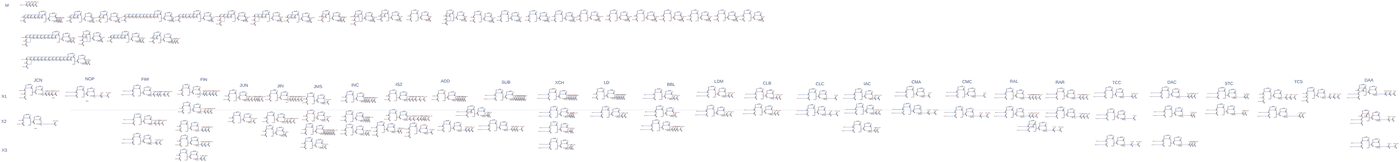
[diagram p0: schematic simple_micro.asc, whole sheet]
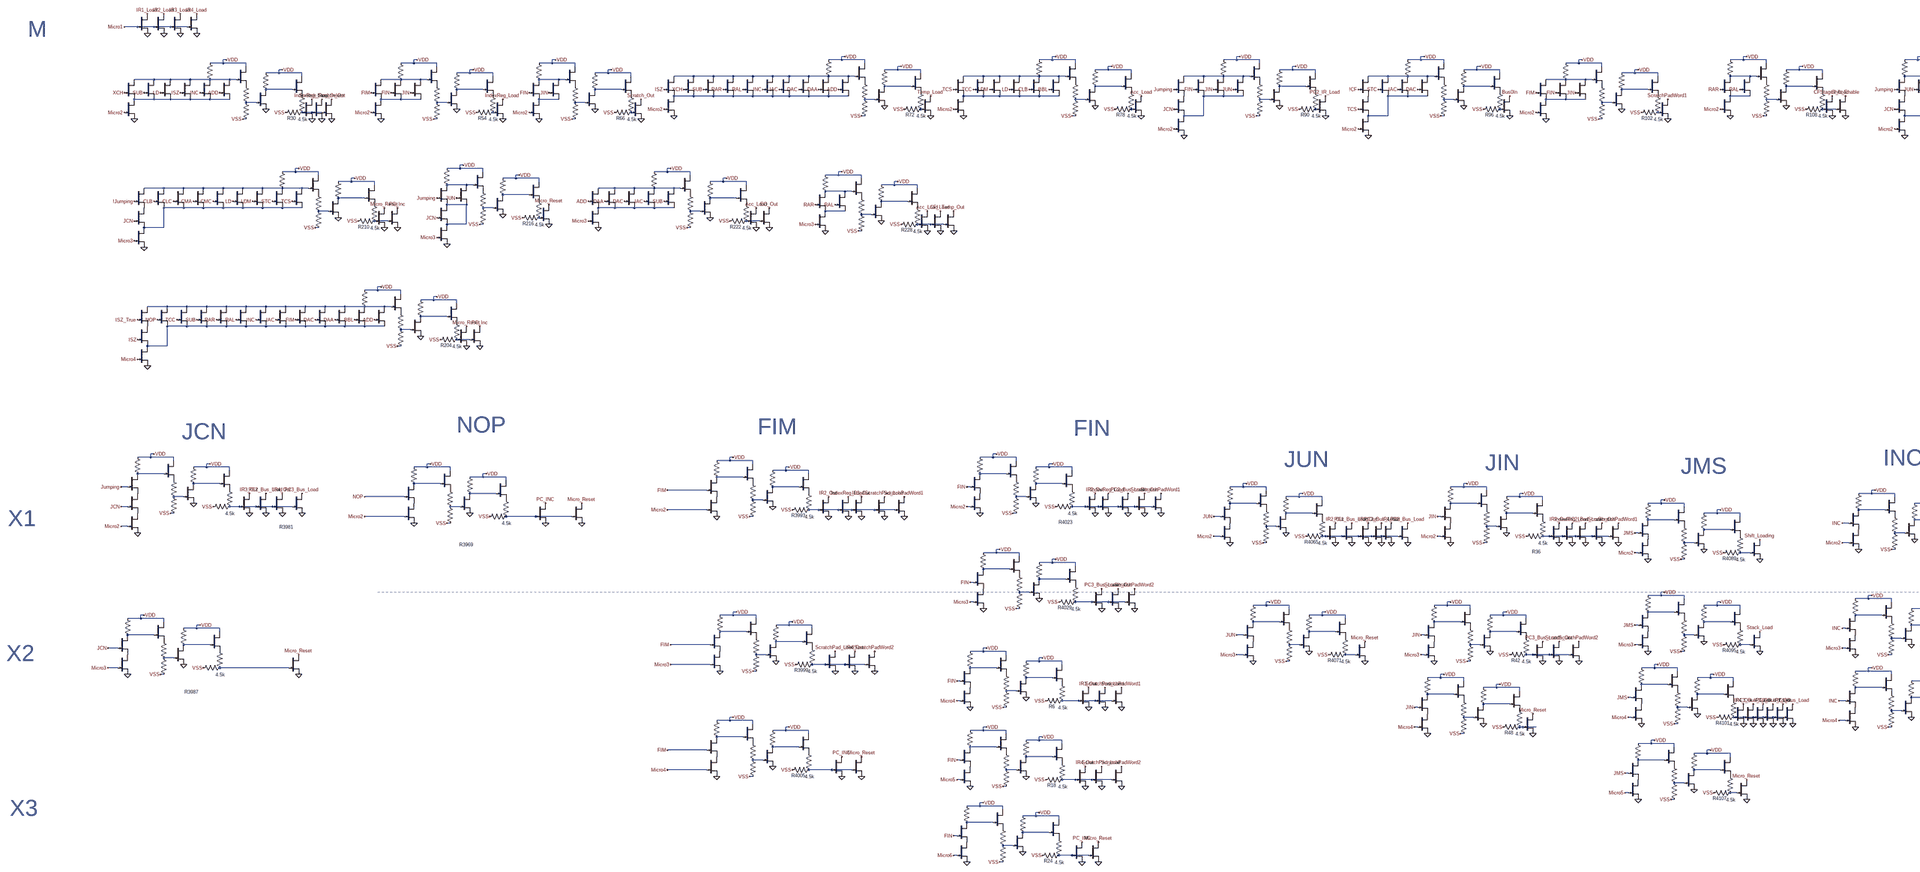
[diagram p1: schematic simple_micro.asc, part, row 1 of 1, column 1 of 4]
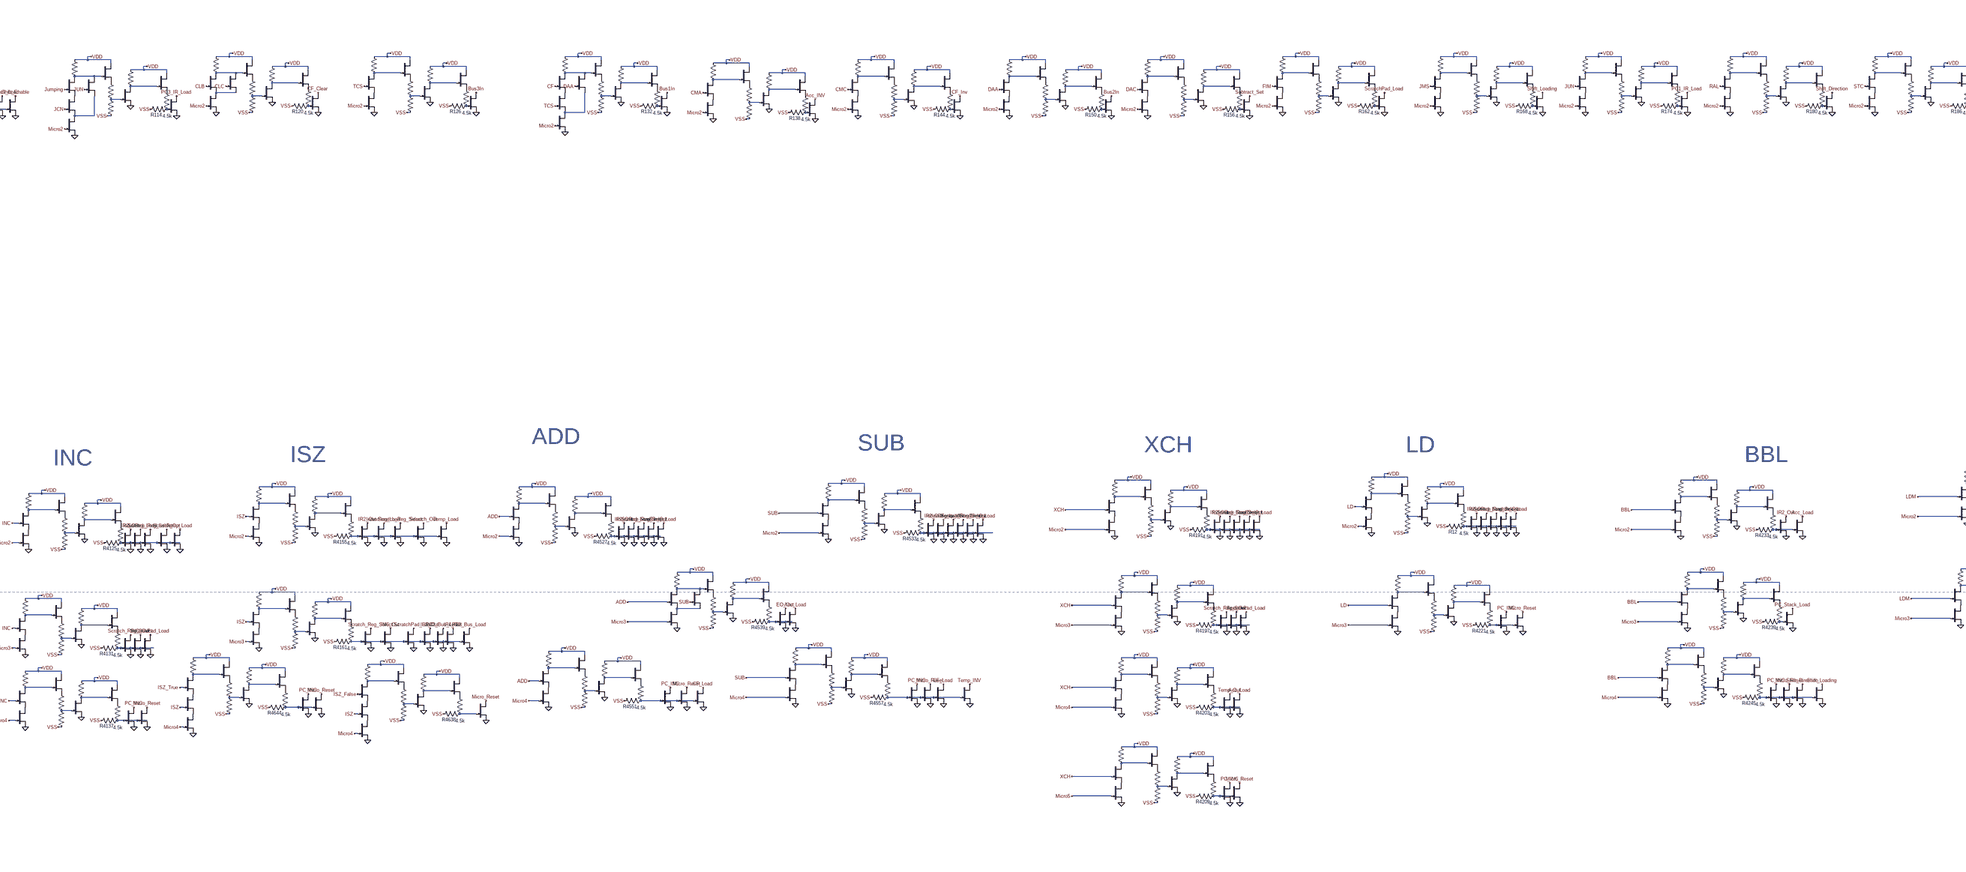
[diagram p2: schematic simple_micro.asc, part, row 1 of 1, column 2 of 4]
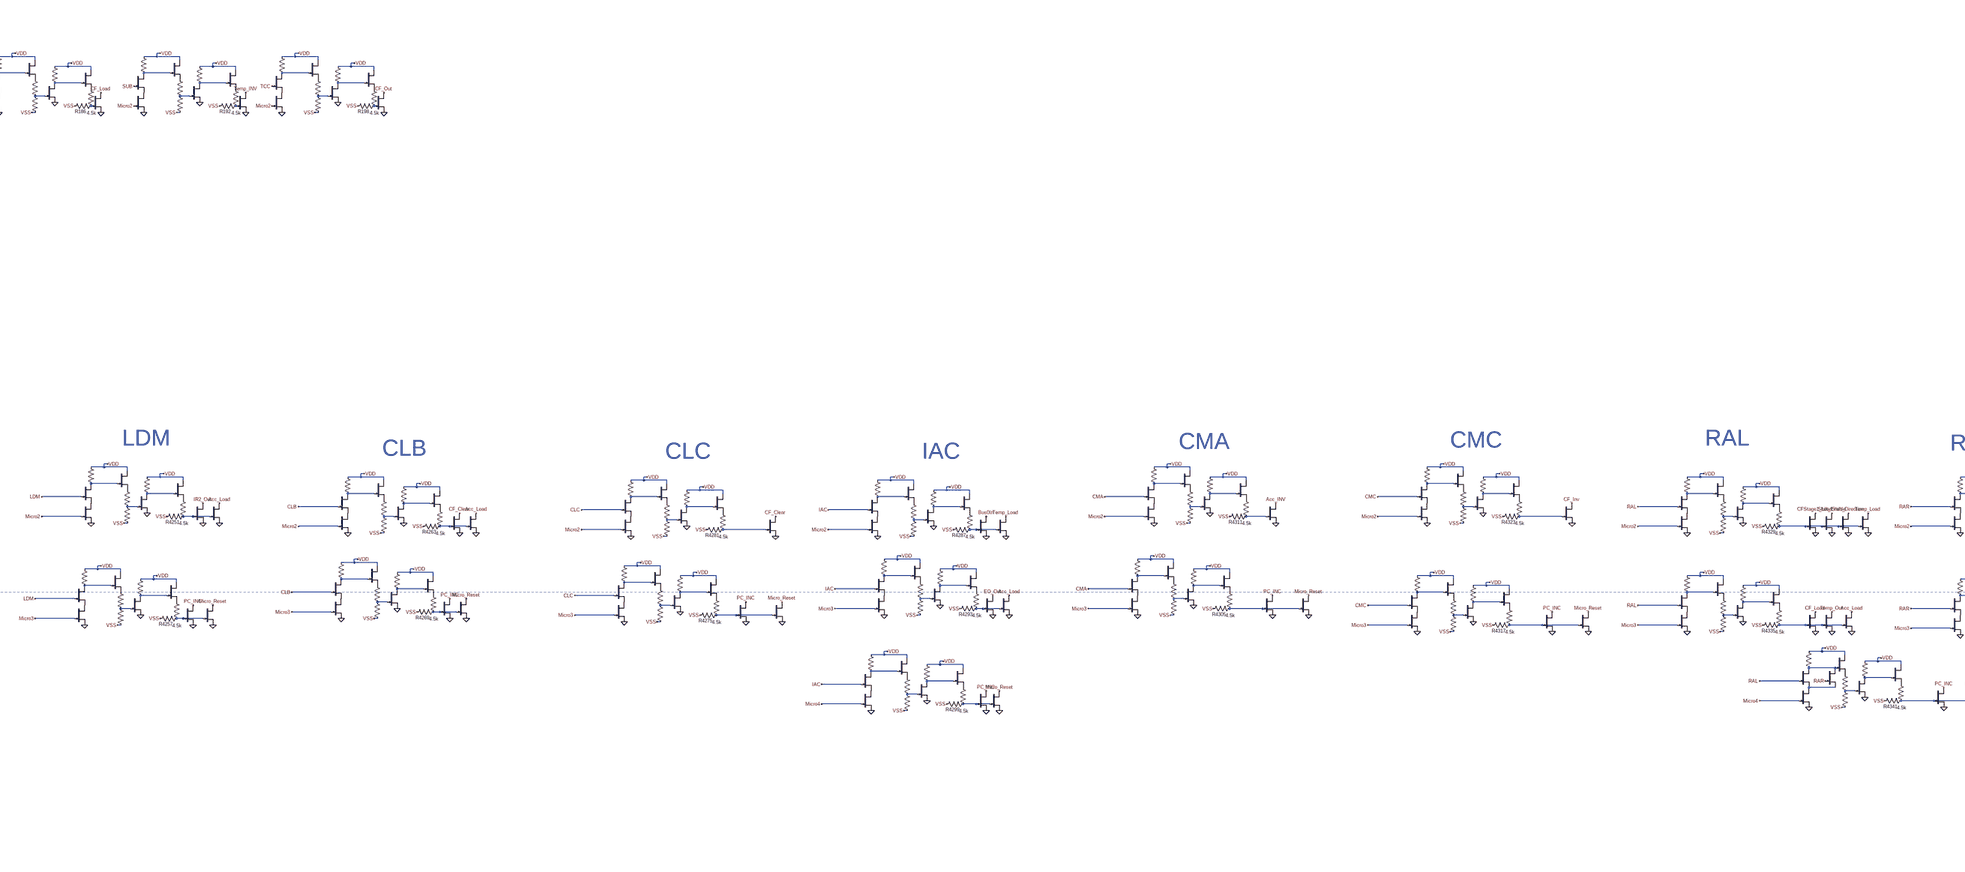
[diagram p3: schematic simple_micro.asc, part, row 1 of 1, column 3 of 4]
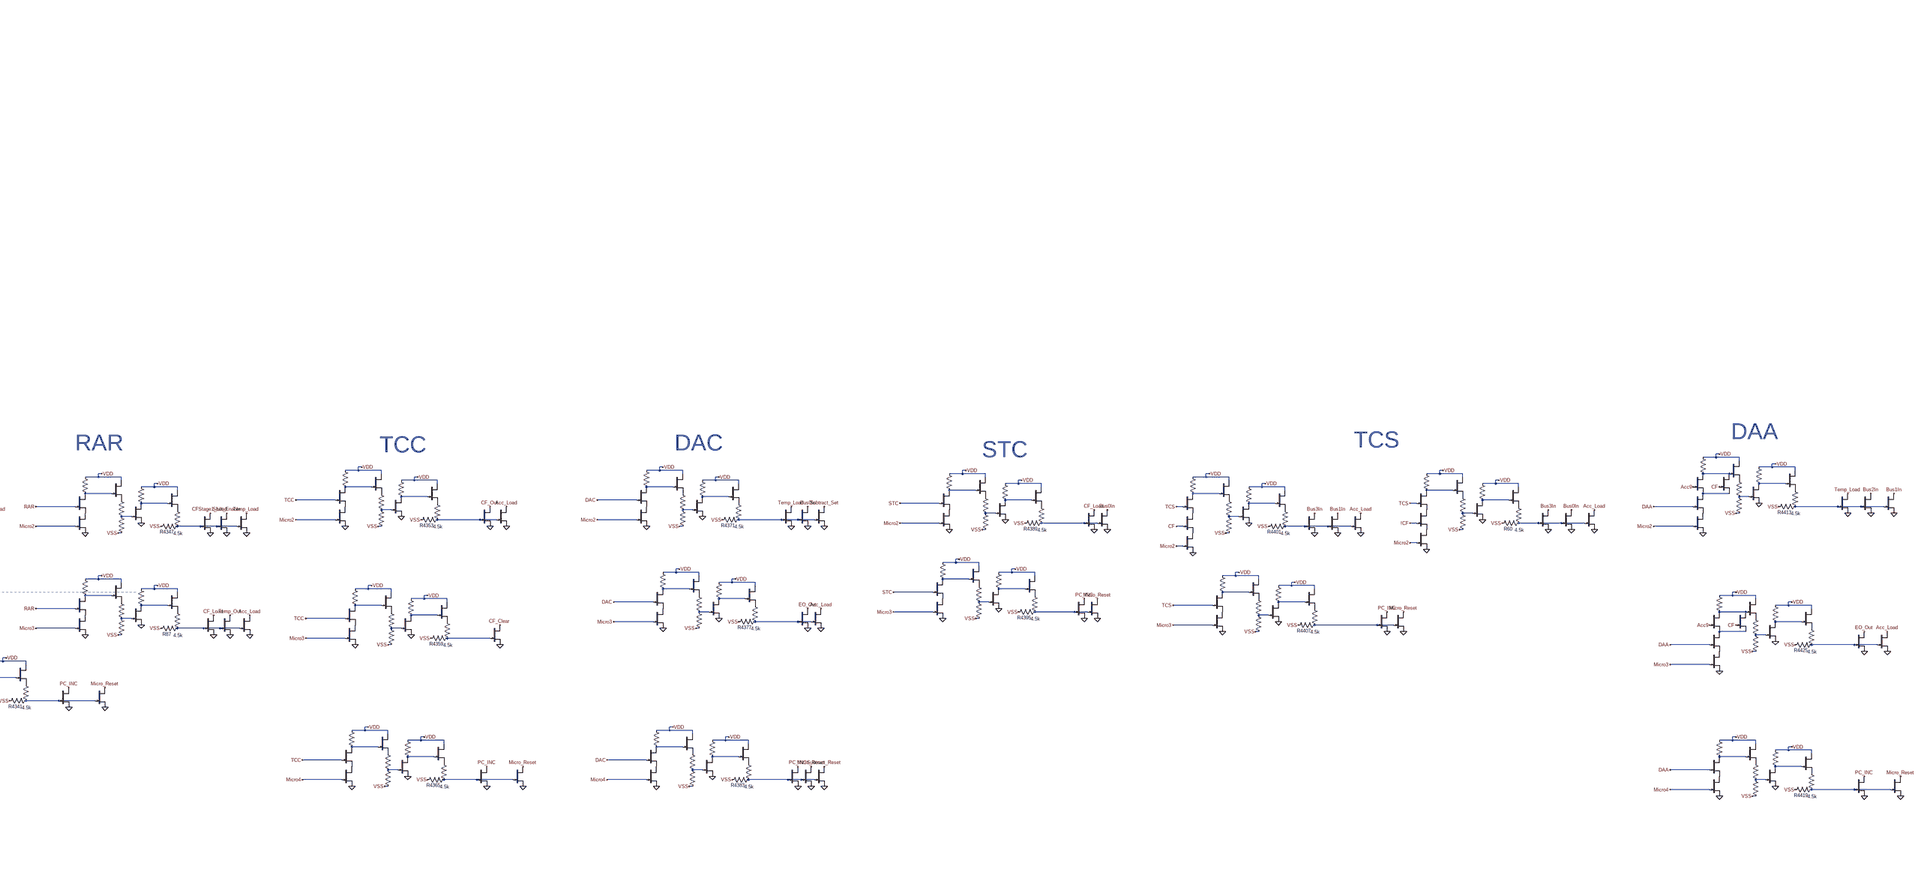
[diagram p4: schematic simple_micro.asc, part, row 1 of 1, column 4 of 4]
* simple_micro.asc
J_A2433 N116 NOP P001 DR
R3964 VDD N116 100k
J_F1003 VDD N116 P002 DR
R3965 P002 N160 1k
R3966 N160 VSS 4.8k
J_B1138 P001 Micro2 0 DR
J_A2434 N127 N160 0 DR
R3967 VDD N127 50k
J_F1004 VDD N127 P003 DR
R3968 P003 N181 1k
R3969 N181 VSS 4.5k
J_Input29 PC_INC N181 0 DR
J_Input30 Micro_Reset N181 0 DR
J_Input31 IR3_Out N159 0 DR
J_Input32 PC2_Bus_Load N159 0 DR
J_A2437 P004 JCN P005 DR
R3976 VDD N111 100k
J_F1007 VDD N111 P006 DR
R3977 P006 N137 1k
R3978 N137 VSS 4.8k
J_B1140 P005 Micro2 0 DR
J_A2438 N115 N137 0 DR
R3979 VDD N115 50k
J_F1008 VDD N115 P007 DR
R3980 P007 N159 1k
R3981 N159 VSS 4.5k
J_Input33 IR4_Out N159 0 DR
J_Input34 PC3_Bus_Load N159 0 DR
J_A2439 N307 JCN P008 DR
R3982 VDD N307 100k
J_F1009 VDD N307 P009 DR
R3983 P009 N323 1k
R3984 N323 VSS 4.8k
J_B1141 P008 Micro3 0 DR
J_A2440 N314 N323 0 DR
R3985 VDD N314 50k
J_F1010 VDD N314 P010 DR
R3986 P010 N327 1k
R3987 N327 VSS 4.5k
J_Input35 Micro_Reset N327 0 DR
J_A2441 N111 Jumping P004 DR
J_A2443 N114 FIM P011 DR
R3988 VDD N114 100k
J_F1011 VDD N114 P012 DR
R3989 P012 N146 1k
R3990 N146 VSS 4.8k
J_B1142 P011 Micro2 0 DR
J_A2444 N122 N146 0 DR
R3991 VDD N122 50k
J_F1012 VDD N122 P013 DR
R3992 P013 N170 1k
R3993 N170 VSS 4.5k
J_Input36 IR2_Out N170 0 DR
J_Input38 IndexReg_Load N170 0 DR
J_A2445 N302 FIM P014 DR
R3994 VDD N302 100k
J_F1013 VDD N302 P015 DR
R3995 P015 N320 1k
R3996 N320 VSS 4.8k
J_B1143 P014 Micro3 0 DR
J_A2446 N312 N320 0 DR
R3997 VDD N312 50k
J_F1014 VDD N312 P016 DR
R3998 P016 N324 1k
R3999 N324 VSS 4.5k
J_Input39 IR3_Out N170 0 DR
J_Input40 ScratchPad_Load N170 0 DR
J_A2447 N375 FIM P017 DR
R4000 VDD N375 100k
J_F1015 VDD N375 P018 DR
R4001 P018 N384 1k
R4002 N384 VSS 4.8k
J_B1144 P017 Micro4 0 DR
J_A2448 N376 N384 0 DR
R4003 VDD N376 50k
J_F1016 VDD N376 P019 DR
R4004 P019 N388 1k
R4005 N388 VSS 4.5k
J_Input41 IR4_Out N324 0 DR
J_Input43 ScratchPad_Load N324 0 DR
J_Input46 PC_INC N388 0 DR
J_Input47 Micro_Reset N388 0 DR
J_Input49 IndexReg_Load N161 0 DR
J_A2453 N112 FIN P020 DR
R4018 VDD N112 100k
J_F1021 VDD N112 P021 DR
R4019 P021 N138 1k
R4020 N138 VSS 4.8k
J_B1147 P020 Micro2 0 DR
J_A2454 N117 N138 0 DR
R4021 VDD N117 50k
J_F1022 VDD N117 P022 DR
R4022 P022 N161 1k
R4023 N161 VSS 4.5k
J_Input50 IR2_Out N161 0 DR
J_A2455 N224 FIN P023 DR
R4024 VDD N224 100k
J_F1023 VDD N224 P024 DR
R4025 P024 N239 1k
R4026 N239 VSS 4.8k
J_B1148 P023 Micro3 0 DR
J_A2456 N227 N239 0 DR
R4027 VDD N227 50k
J_F1024 VDD N227 P025 DR
R4028 P025 N253 1k
R4029 N253 VSS 4.5k
J_Input51 PC2_Bus_Load N161 0 DR
J_Input53 Scratch_Out N161 0 DR
J_Input59 PC_INC N406 0 DR
J_Input60 Micro_Reset N406 0 DR
J_A2467 N150 JUN P026 DR
R4060 VDD N150 100k
J_F1035 VDD N150 P027 DR
R4061 P027 N201 1k
R4062 N201 VSS 4.8k
J_B1154 P026 Micro2 0 DR
J_A2468 N175 N201 0 DR
R4063 VDD N175 50k
J_F1036 VDD N175 P028 DR
R4064 P028 N217 1k
R4065 N217 VSS 4.5k
J_Input71 IR2_Out N217 0 DR
J_Input72 PC1_Bus_Load N217 0 DR
J_A2469 N287 JUN P029 DR
R4066 VDD N287 100k
J_F1037 VDD N287 P030 DR
R4067 P030 N315 1k
R4068 N315 VSS 4.8k
J_B1155 P029 Micro3 0 DR
J_A2470 N303 N315 0 DR
R4069 VDD N303 50k
J_F1038 VDD N303 P031 DR
R4070 P031 N321 1k
R4071 N321 VSS 4.5k
J_Input73 IR3_Out N217 0 DR
J_Input74 PC2_Bus_Load N217 0 DR
J_Input75 IR4_Out N217 0 DR
J_Input76 PC3_Bus_Load N217 0 DR
J_Input78 Micro_Reset N321 0 DR
J_A2475 N190 JMS P032 DR
R4084 VDD N190 100k
J_F1043 VDD N190 P033 DR
R4085 P033 N221 1k
R4086 N221 VSS 4.8k
J_B1158 P032 Micro2 0 DR
J_A2476 N210 N221 0 DR
R4087 VDD N210 50k
J_F1044 VDD N210 P034 DR
R4088 P034 N223 1k
R4089 N223 VSS 4.5k
J_Input94 Shift_Loading N223 0 DR
J_A2477 N269 JMS P035 DR
R4090 VDD N269 100k
J_F1045 VDD N269 P036 DR
R4091 P036 N308 1k
R4092 N308 VSS 4.8k
J_B1159 P035 Micro3 0 DR
J_A2478 N289 N308 0 DR
R4093 VDD N289 50k
J_F1046 VDD N289 P037 DR
R4094 P037 N317 1k
R4095 N317 VSS 4.5k
J_Input95 Stack_Load N317 0 DR
J_A2479 N341 JMS P038 DR
R4096 VDD N341 100k
J_F1047 VDD N341 P039 DR
R4097 P039 N366 1k
R4098 N366 VSS 4.8k
J_B1160 P038 Micro4 0 DR
J_A2480 N353 N366 0 DR
R4099 VDD N353 50k
J_F1048 VDD N353 P040 DR
R4100 P040 N372 1k
R4101 N372 VSS 4.5k
J_Input96 IR2_Out N372 0 DR
J_Input97 PC1_Bus_Load N372 0 DR
J_A2481 N385 JMS P041 DR
R4102 VDD N385 100k
J_F1049 VDD N385 P042 DR
R4103 P042 N398 1k
R4104 N398 VSS 4.8k
J_B1161 P041 Micro5 0 DR
J_A2482 N390 N398 0 DR
R4105 VDD N390 50k
J_F1050 VDD N390 P043 DR
R4106 P043 N401 1k
R4107 N401 VSS 4.5k
J_Input98 IR3_Out N372 0 DR
J_Input99 PC2_Bus_Load N372 0 DR
J_Input100 IR4_Out N372 0 DR
J_Input101 PC3_Bus_Load N372 0 DR
J_Input103 Micro_Reset N401 0 DR
J_A2487 N171 INC P044 DR
R4120 VDD N171 100k
J_F1055 VDD N171 P045 DR
R4121 P045 N215 1k
R4122 N215 VSS 4.8k
J_B1164 P044 Micro2 0 DR
J_A2488 N191 N215 0 DR
R4123 VDD N191 50k
J_F1056 VDD N191 P046 DR
R4124 P046 N222 1k
R4125 N222 VSS 4.5k
J_Input104 IR2_Out N222 0 DR
J_Input105 IndexReg_Load N222 0 DR
J_A2489 N276 INC P047 DR
R4126 VDD N276 100k
J_F1057 VDD N276 P048 DR
R4127 P048 N310 1k
R4128 N310 VSS 4.8k
J_B1165 P047 Micro3 0 DR
J_A2490 N294 N310 0 DR
R4129 VDD N294 50k
J_F1058 VDD N294 P049 DR
R4130 P049 N319 1k
R4131 N319 VSS 4.5k
J_Input106 Scratch_Out N222 0 DR
J_Input107 ScratchPad_Load N319 0 DR
J_A2491 N344 INC P050 DR
R4132 VDD N344 100k
J_F1059 VDD N344 P051 DR
R4133 P051 N369 1k
R4134 N369 VSS 4.8k
J_B1166 P050 Micro4 0 DR
J_A2492 N355 N369 0 DR
R4135 VDD N355 50k
J_F1060 VDD N355 P052 DR
R4136 P052 N373 1k
R4137 N373 VSS 4.5k
J_Input108 INC_Out N319 0 DR
J_Input109 Temp_Load N222 0 DR
J_Input112 PC_INC N373 0 DR
J_Input113 Micro_Reset N373 0 DR
J_A2497 N152 ISZ P053 DR
R4150 VDD N152 100k
J_F1065 VDD N152 P054 DR
R4151 P054 N203 1k
R4152 N203 VSS 4.8k
J_B1169 P053 Micro2 0 DR
J_A2498 N177 N203 0 DR
R4153 VDD N177 50k
J_F1066 VDD N177 P055 DR
R4154 P055 N219 1k
R4155 N219 VSS 4.5k
J_Input114 IR2_Out N219 0 DR
J_Input115 IndexReg_Load N219 0 DR
J_A2499 N264 ISZ P056 DR
R4156 VDD N264 100k
J_F1067 VDD N264 P057 DR
R4157 P057 N305 1k
R4158 N305 VSS 4.8k
J_B1170 P056 Micro3 0 DR
J_A2500 N284 N305 0 DR
R4159 VDD N284 50k
J_F1068 VDD N284 P058 DR
R4160 P058 N313 1k
R4161 N313 VSS 4.5k
J_Input116 Scratch_Out N219 0 DR
J_Input119 Temp_Load N219 0 DR
J_Input122 PC_INC N367 0 DR
J_Input123 Micro_Reset N367 0 DR
J_Input124 PC2_Bus_Load N313 0 DR
J_Input125 IR3_Out N313 0 DR
J_Input126 IR4_Out N313 0 DR
J_Input127 PC3_Bus_Load N313 0 DR
J_A2511 N139 XCH P059 DR
R4186 VDD N139 100k
J_F1077 VDD N139 P060 DR
R4187 P060 N192 1k
R4188 N192 VSS 4.8k
J_B1175 P059 Micro2 0 DR
J_A2512 N162 N192 0 DR
R4189 VDD N162 50k
J_F1078 VDD N162 P061 DR
R4190 P061 N211 1k
R4191 N211 VSS 4.5k
J_Input128 IR2_Out N211 0 DR
J_Input129 IndexReg_Load N211 0 DR
J_A2513 N240 XCH P062 DR
R4192 VDD N240 100k
J_F1079 VDD N240 P063 DR
R4193 P063 N277 1k
R4194 N277 VSS 4.8k
J_B1176 P062 Micro3 0 DR
J_A2514 N254 N277 0 DR
R4195 VDD N254 50k
J_F1080 VDD N254 P064 DR
R4196 P064 N295 1k
R4197 N295 VSS 4.5k
J_Input130 Scratch_Out N211 0 DR
J_Input131 Temp_Load N211 0 DR
J_A2515 N334 XCH P065 DR
R4198 VDD N334 100k
J_F1081 VDD N334 P066 DR
R4199 P066 N358 1k
R4200 N358 VSS 4.8k
J_B1177 P065 Micro4 0 DR
J_A2516 N343 N358 0 DR
R4201 VDD N343 50k
J_F1082 VDD N343 P067 DR
R4202 P067 N368 1k
R4203 N368 VSS 4.5k
J_Input132 Acc_Out N295 0 DR
J_Input133 ScratchPad_Load N295 0 DR
J_A2517 N386 XCH P068 DR
R4204 VDD N386 100k
J_F1083 VDD N386 P069 DR
R4205 P069 N399 1k
R4206 N399 VSS 4.8k
J_B1178 P068 Micro5 0 DR
J_A2518 N393 N399 0 DR
R4207 VDD N393 50k
J_F1084 VDD N393 P070 DR
R4208 P070 N402 1k
R4209 N402 VSS 4.5k
J_Input134 Temp_Out N368 0 DR
J_Input135 Acc_Load N368 0 DR
J_Input136 PC_INC N402 0 DR
J_Input137 Micro_Reset N402 0 DR
J_A2521 N241 LD P071 DR
R4216 VDD N241 100k
J_F1087 VDD N241 P072 DR
R4217 P072 N278 1k
R4218 N278 VSS 4.8k
J_B1180 P071 Micro3 0 DR
J_A2522 N255 N278 0 DR
R4219 VDD N255 50k
J_F1088 VDD N255 P073 DR
R4220 P073 N296 1k
R4221 N296 VSS 4.5k
J_Input138 Scratch_Out N205 0 DR
J_Input139 Acc_Load N205 0 DR
J_Input140 PC_INC N296 0 DR
J_Input141 Micro_Reset N296 0 DR
J_A2526 N140 BBL P074 DR
R4228 VDD N140 100k
J_F1091 VDD N140 P075 DR
R4229 P075 N193 1k
R4230 N193 VSS 4.8k
J_B1182 P074 Micro2 0 DR
J_A2527 N163 N193 0 DR
R4231 VDD N163 50k
J_F1092 VDD N163 P076 DR
R4232 P076 N212 1k
R4233 N212 VSS 4.5k
J_Input142 IR2_Out N212 0 DR
J_Input143 Acc_Load N212 0 DR
J_Input144 Shift_Direction N359 0 DR
J_Input145 Shift_Loading N359 0 DR
J_A2528 N235 BBL P077 DR
R4234 VDD N235 100k
J_F1093 VDD N235 P078 DR
R4235 P078 N271 1k
R4236 N271 VSS 4.8k
J_B1183 P077 Micro3 0 DR
J_A2529 N249 N271 0 DR
R4237 VDD N249 50k
J_F1094 VDD N249 P079 DR
R4238 P079 N291 1k
R4239 N291 VSS 4.5k
J_Input146 PC_Stack_Load N291 0 DR
J_A2530 N326 BBL P080 DR
R4240 VDD N326 100k
J_F1095 VDD N326 P081 DR
R4241 P081 N346 1k
R4242 N346 VSS 4.8k
J_B1184 P080 Micro4 0 DR
J_A2531 N335 N346 0 DR
R4243 VDD N335 50k
J_F1096 VDD N335 P082 DR
R4244 P082 N359 1k
R4245 N359 VSS 4.5k
J_Input147 PC_INC N359 0 DR
J_Input148 Micro_Reset N359 0 DR
J_A2532 N118 LDM P083 DR
R4246 VDD N118 100k
J_F1097 VDD N118 P084 DR
R4247 P084 N164 1k
R4248 N164 VSS 4.8k
J_B1185 P083 Micro2 0 DR
J_A2533 N129 N164 0 DR
R4249 VDD N129 50k
J_F1098 VDD N129 P085 DR
R4250 P085 N183 1k
R4251 N183 VSS 4.5k
J_Input149 IR2_Out N183 0 DR
J_Input150 Acc_Load N183 0 DR
J_A2534 N231 LDM P086 DR
R4252 VDD N231 100k
J_F1099 VDD N231 P087 DR
R4253 P087 N266 1k
R4254 N266 VSS 4.8k
J_B1186 P086 Micro3 0 DR
J_A2535 N246 N266 0 DR
R4255 VDD N246 50k
J_F1100 VDD N246 P088 DR
R4256 P088 N285 1k
R4257 N285 VSS 4.5k
J_Input151 PC_INC N285 0 DR
J_Input152 Micro_Reset N285 0 DR
J_Input153 Acc_Load N206 0 DR
J_A2536 N130 CLB P089 DR
R4258 VDD N130 100k
J_F1101 VDD N130 P090 DR
R4259 P090 N184 1k
R4260 N184 VSS 4.8k
J_B1187 P089 Micro2 0 DR
J_A2537 N155 N184 0 DR
R4261 VDD N155 50k
J_F1102 VDD N155 P091 DR
R4262 P091 N206 1k
R4263 N206 VSS 4.5k
J_Input154 CF_Clear N206 0 DR
J_A2538 N228 CLB P092 DR
R4264 VDD N228 100k
J_F1103 VDD N228 P093 DR
R4265 P093 N256 1k
R4266 N256 VSS 4.8k
J_B1188 P092 Micro3 0 DR
J_A2539 N236 N256 0 DR
R4267 VDD N236 50k
J_F1104 VDD N236 P094 DR
R4268 P094 N272 1k
R4269 N272 VSS 4.5k
J_Input155 PC_INC N272 0 DR
J_Input156 Micro_Reset N272 0 DR
J_A2540 N230 CLC P095 DR
R4270 VDD N230 100k
J_F1105 VDD N230 P096 DR
R4271 P096 N261 1k
R4272 N261 VSS 4.8k
J_B1189 P095 Micro3 0 DR
J_A2541 N242 N261 0 DR
R4273 VDD N242 50k
J_F1106 VDD N242 P097 DR
R4274 P097 N279 1k
R4275 N279 VSS 4.5k
J_Input157 PC_INC N279 0 DR
J_Input158 Micro_Reset N279 0 DR
J_A2542 N141 CLC P098 DR
R4276 VDD N141 100k
J_F1107 VDD N141 P099 DR
R4277 P099 N194 1k
R4278 N194 VSS 4.8k
J_B1190 P098 Micro2 0 DR
J_A2543 N165 N194 0 DR
R4279 VDD N165 50k
J_F1108 VDD N165 P100 DR
R4280 P100 N213 1k
R4281 N213 VSS 4.5k
J_Input159 CF_Clear N213 0 DR
J_Input160 Temp_Load N214 0 DR
J_A2544 N142 IAC P101 DR
R4282 VDD N142 100k
J_F1109 VDD N142 P102 DR
R4283 P102 N195 1k
R4284 N195 VSS 4.8k
J_B1191 P101 Micro2 0 DR
J_A2545 N166 N195 0 DR
R4285 VDD N166 50k
J_F1110 VDD N166 P103 DR
R4286 P103 N214 1k
R4287 N214 VSS 4.5k
J_Input161 Bus0In N214 0 DR
J_A2546 N225 IAC P104 DR
R4288 VDD N225 100k
J_F1111 VDD N225 P105 DR
R4289 P105 N250 1k
R4290 N250 VSS 4.8k
J_B1192 P104 Micro3 0 DR
J_A2547 N232 N250 0 DR
R4291 VDD N232 50k
J_F1112 VDD N232 P106 DR
R4292 P106 N267 1k
R4293 N267 VSS 4.5k
J_Input162 EO_Out N267 0 DR
J_Input163 Acc_Load N267 0 DR
J_A2548 N331 IAC P107 DR
R4294 VDD N331 100k
J_F1113 VDD N331 P108 DR
R4295 P108 N354 1k
R4296 N354 VSS 4.8k
J_B1193 P107 Micro4 0 DR
J_A2549 N340 N354 0 DR
R4297 VDD N340 50k
J_F1114 VDD N340 P109 DR
R4298 P109 N365 1k
R4299 N365 VSS 4.5k
J_Input164 PC_INC N365 0 DR
J_Input165 Micro_Reset N365 0 DR
J_A2550 N226 CMA P110 DR
R4300 VDD N226 100k
J_F1115 VDD N226 P111 DR
R4301 P111 N251 1k
R4302 N251 VSS 4.8k
J_B1194 P110 Micro3 0 DR
J_A2551 N233 N251 0 DR
R4303 VDD N233 50k
J_F1116 VDD N233 P112 DR
R4304 P112 N268 1k
R4305 N268 VSS 4.5k
J_Input166 PC_INC N268 0 DR
J_Input167 Micro_Reset N268 0 DR
J_A2552 N119 CMA P113 DR
R4306 VDD N119 100k
J_F1117 VDD N119 P114 DR
R4307 P114 N167 1k
R4308 N167 VSS 4.8k
J_B1195 P113 Micro2 0 DR
J_A2553 N131 N167 0 DR
R4309 VDD N131 50k
J_F1118 VDD N131 P115 DR
R4310 P115 N185 1k
R4311 N185 VSS 4.5k
J_Input168 Acc_INV N185 0 DR
J_A2554 N243 CMC P116 DR
R4312 VDD N243 100k
J_F1119 VDD N243 P117 DR
R4313 P117 N280 1k
R4314 N280 VSS 4.8k
J_B1196 P116 Micro3 0 DR
J_A2555 N257 N280 0 DR
R4315 VDD N257 50k
J_F1120 VDD N257 P118 DR
R4316 P118 N297 1k
R4317 N297 VSS 4.5k
J_Input169 PC_INC N297 0 DR
J_Input170 Micro_Reset N297 0 DR
J_A2556 N120 CMC P119 DR
R4318 VDD N120 100k
J_F1121 VDD N120 P120 DR
R4319 P120 N168 1k
R4320 N168 VSS 4.8k
J_B1197 P119 Micro2 0 DR
J_A2557 N132 N168 0 DR
R4321 VDD N132 50k
J_F1122 VDD N132 P121 DR
R4322 P121 N186 1k
R4323 N186 VSS 4.5k
J_Input171 CF_Inv N186 0 DR
J_A2558 N133 RAL P122 DR
R4324 VDD N133 100k
J_F1123 VDD N133 P123 DR
R4325 P123 N187 1k
R4326 N187 VSS 4.8k
J_B1198 P122 Micro2 0 DR
J_A2559 N156 N187 0 DR
R4327 VDD N156 50k
J_F1124 VDD N156 P124 DR
R4328 P124 N207 1k
R4329 N207 VSS 4.5k
J_Input172 Shift_Enable N207 0 DR
J_Input173 Temp_Load N207 0 DR
J_Input174 Shift_Direction N207 0 DR
J_A2560 N244 RAL P125 DR
R4330 VDD N244 100k
J_F1125 VDD N244 P126 DR
R4331 P126 N281 1k
R4332 N281 VSS 4.8k
J_B1199 P125 Micro3 0 DR
J_A2561 N258 N281 0 DR
R4333 VDD N258 50k
J_F1126 VDD N258 P127 DR
R4334 P127 N298 1k
R4335 N298 VSS 4.5k
J_Input175 Temp_Out N298 0 DR
J_Input176 Acc_Load N298 0 DR
J_A2562 N330 RAL N347 DR
R4336 VDD N330 100k
J_F1127 VDD N330 P128 DR
R4337 P128 N351 1k
R4338 N351 VSS 4.8k
J_B1200 N347 Micro4 0 DR
J_A2563 N338 N351 0 DR
R4339 VDD N338 50k
J_F1128 VDD N338 P129 DR
R4340 P129 N362 1k
R4341 N362 VSS 4.5k
J_Input177 PC_INC N362 0 DR
J_Input178 Micro_Reset N362 0 DR
J_A2564 N134 RAR P130 DR
R4342 VDD N134 100k
J_F1129 VDD N134 P131 DR
R4343 P131 N188 1k
R4344 N188 VSS 4.8k
J_B1201 P130 Micro2 0 DR
J_A2565 N157 N188 0 DR
R4345 VDD N157 50k
J_F1130 VDD N157 P132 DR
R4346 P132 N208 1k
R4347 N208 VSS 4.5k
J_A2567 N330 RAR N347 DR
J_A2568 N123 TCC P133 DR
R4348 VDD N123 100k
J_F1131 VDD N123 P134 DR
R4349 P134 N173 1k
R4350 N173 VSS 4.8k
J_B1202 P133 Micro2 0 DR
J_A2569 N143 N173 0 DR
R4351 VDD N143 50k
J_F1132 VDD N143 P135 DR
R4352 P135 N196 1k
R4353 N196 VSS 4.5k
J_Input181 CF_Out N196 0 DR
J_Input182 Acc_Load N196 0 DR
J_A2570 N263 TCC P136 DR
R4354 VDD N263 100k
J_F1133 VDD N263 P137 DR
R4355 P137 N301 1k
R4356 N301 VSS 4.8k
J_B1203 P136 Micro3 0 DR
J_A2571 N282 N301 0 DR
R4357 VDD N282 50k
J_F1134 VDD N282 P138 DR
R4358 P138 N311 1k
R4359 N311 VSS 4.5k
J_Input183 CF_Clear N311 0 DR
J_A2572 N378 TCC P139 DR
R4360 VDD N378 100k
J_F1135 VDD N378 P140 DR
R4361 P140 N391 1k
R4362 N391 VSS 4.8k
J_B1204 P139 Micro4 0 DR
J_A2573 N381 N391 0 DR
R4363 VDD N381 50k
J_F1136 VDD N381 P141 DR
R4364 P141 N395 1k
R4365 N395 VSS 4.5k
J_Input184 PC_INC N395 0 DR
J_Input185 Micro_Reset N395 0 DR
J_A2574 N124 DAC P142 DR
R4366 VDD N124 100k
J_F1137 VDD N124 P143 DR
R4367 P143 N174 1k
R4368 N174 VSS 4.8k
J_B1205 P142 Micro2 0 DR
J_A2575 N144 N174 0 DR
R4369 VDD N144 50k
J_F1138 VDD N144 P144 DR
R4370 P144 N197 1k
R4371 N197 VSS 4.5k
J_Input186 Bus0In N197 0 DR
J_Input187 Temp_Load N197 0 DR
J_Input188 Subtract_Set N197 0 DR
J_A2576 N237 DAC P145 DR
R4372 VDD N237 100k
J_F1139 VDD N237 P146 DR
R4373 P146 N273 1k
R4374 N273 VSS 4.8k
J_B1206 P145 Micro3 0 DR
J_A2577 N252 N273 0 DR
R4375 VDD N252 50k
J_F1140 VDD N252 P147 DR
R4376 P147 N292 1k
R4377 N292 VSS 4.5k
J_Input189 EO_Out N292 0 DR
J_Input190 Subtract_Reset N396 0 DR
J_Input191 Acc_Load N292 0 DR
J_A2578 N379 DAC P148 DR
R4378 VDD N379 100k
J_F1141 VDD N379 P149 DR
R4379 P149 N392 1k
R4380 N392 VSS 4.8k
J_B1207 P148 Micro4 0 DR
J_A2579 N382 N392 0 DR
R4381 VDD N382 50k
J_F1142 VDD N382 P150 DR
R4382 P150 N396 1k
R4383 N396 VSS 4.5k
J_Input192 PC_INC N396 0 DR
J_Input193 Micro_Reset N396 0 DR
J_Input194 Bus0In N199 0 DR
J_A2580 N125 STC P151 DR
R4384 VDD N125 100k
J_F1143 VDD N125 P152 DR
R4385 P152 N179 1k
R4386 N179 VSS 4.8k
J_B1208 P151 Micro2 0 DR
J_A2581 N148 N179 0 DR
R4387 VDD N148 50k
J_F1144 VDD N148 P153 DR
R4388 P153 N199 1k
R4389 N199 VSS 4.5k
J_Input195 CF_Load N199 0 DR
J_A2582 N229 STC P154 DR
R4390 VDD N229 100k
J_F1145 VDD N229 P155 DR
R4391 P155 N259 1k
R4392 N259 VSS 4.8k
J_B1209 P154 Micro3 0 DR
J_A2583 N238 N259 0 DR
R4393 VDD N238 50k
J_F1146 VDD N238 P156 DR
R4394 P156 N274 1k
R4395 N274 VSS 4.5k
J_Input196 PC_INC N274 0 DR
J_Input197 Micro_Reset N274 0 DR
J_A2584 N135 TCS P157 DR
R4396 VDD N135 100k
J_F1147 VDD N135 P158 DR
R4397 P158 N189 1k
R4398 N189 VSS 4.8k
J_B1210 P159 Micro2 0 DR
J_A2585 N158 N189 0 DR
R4399 VDD N158 50k
J_F1148 VDD N158 P160 DR
R4400 P160 N209 1k
R4401 N209 VSS 4.5k
J_Input198 Bus3In N209 0 DR
J_A2586 N245 TCS P161 DR
R4402 VDD N245 100k
J_F1149 VDD N245 P162 DR
R4403 P162 N283 1k
R4404 N283 VSS 4.8k
J_B1211 P161 Micro3 0 DR
J_A2587 N260 N283 0 DR
R4405 VDD N260 50k
J_F1150 VDD N260 P163 DR
R4406 P163 N299 1k
R4407 N299 VSS 4.5k
J_Input200 Acc_Load N209 0 DR
J_Input201 PC_INC N299 0 DR
J_Input202 Micro_Reset N299 0 DR
J_A2588 N136 DAA P164 DR
R4408 VDD N113 100k
J_F1151 VDD N113 P165 DR
R4409 P165 N145 1k
R4410 N145 VSS 4.8k
J_B1212 P164 Micro2 0 DR
J_A2589 N121 N145 0 DR
R4411 VDD N121 50k
J_F1152 VDD N121 P166 DR
R4412 P166 N169 1k
R4413 N169 VSS 4.5k
J_Input203 Temp_Load N169 0 DR
J_Input204 Bus2In N169 0 DR
J_A2590 N383 DAA P167 DR
R4414 VDD N383 100k
J_F1153 VDD N383 P168 DR
R4415 P168 N397 1k
R4416 N397 VSS 4.8k
J_B1213 P167 Micro4 0 DR
J_A2591 N387 N397 0 DR
R4417 VDD N387 50k
J_F1154 VDD N387 P169 DR
R4418 P169 N400 1k
R4419 N400 VSS 4.5k
J_Input205 Bus1In N169 0 DR
J_Input206 PC_INC N400 0 DR
J_Input207 Micro_Reset N400 0 DR
J_A2592 N306 DAA P170 DR
R4420 VDD N275 100k
J_F1155 VDD N275 P171 DR
R4421 P171 N309 1k
R4422 N309 VSS 4.8k
J_B1214 P170 Micro3 0 DR
J_A2593 N293 N309 0 DR
R4423 VDD N293 50k
J_F1156 VDD N293 P172 DR
R4424 P172 N318 1k
R4425 N318 VSS 4.5k
J_Input208 EO_Out N318 0 DR
J_Input209 Acc_Load N318 0 DR
J_A2594 N113 Acc9 N136 DR
J_A2595 N113 CF N136 DR
J_A2596 N275 Acc9 N306 DR
J_A2597 N275 CF N306 DR
J_A2631 N153 ADD P173 DR
R4522 VDD N153 100k
J_F1189 VDD N153 P174 DR
R4523 P174 N204 1k
R4524 N204 VSS 4.8k
J_B1231 P173 Micro2 0 DR
J_A2632 N178 N204 0 DR
R4525 VDD N178 50k
J_F1190 VDD N178 P175 DR
R4526 P175 N220 1k
R4527 N220 VSS 4.5k
J_A2633 N147 SUB P176 DR
R4528 VDD N147 100k
J_F1191 VDD N147 P177 DR
R4529 P177 N198 1k
R4530 N198 VSS 4.8k
J_B1232 P176 Micro2 0 DR
J_A2634 N172 N198 0 DR
R4531 VDD N172 50k
J_F1192 VDD N172 P178 DR
R4532 P178 N216 1k
R4533 N216 VSS 4.5k
J_Input248 IR2_Out N220 0 DR
J_Input249 IR2_Out N216 0 DR
J_Input250 IndexReg_Load N220 0 DR
J_Input251 IndexReg_Load N216 0 DR
J_A2635 N234 ADD N265 DR
R4534 VDD N234 100k
J_F1193 VDD N234 P179 DR
R4535 P179 N270 1k
R4536 N270 VSS 4.8k
J_B1233 N265 Micro3 0 DR
J_A2636 N248 N270 0 DR
R4537 VDD N248 50k
J_F1194 VDD N248 P180 DR
R4538 P180 N290 1k
R4539 N290 VSS 4.5k
J_Input252 Scratch_Out N220 0 DR
J_Input253 Temp_Load N220 0 DR
J_Input254 EO_Out N290 0 DR
J_Input255 Acc_Load N290 0 DR
J_A2639 N329 ADD P181 DR
R4546 VDD N329 100k
J_F1197 VDD N329 P182 DR
R4547 P182 N350 1k
R4548 N350 VSS 4.8k
J_B1235 P181 Micro4 0 DR
J_A2640 N337 N350 0 DR
R4549 VDD N337 50k
J_F1198 VDD N337 P183 DR
R4550 P183 N361 1k
R4551 N361 VSS 4.5k
J_Input256 PC_INC N361 0 DR
J_Input257 Micro_Reset N361 0 DR
J_Input258 Temp_INV N216 0 DR
J_A2641 N234 SUB N265 DR
J_Input259 CF_Load N361 0 DR
J_A2644 N325 SUB P184 DR
R4552 VDD N325 100k
J_F1199 VDD N325 P185 DR
R4553 P185 N345 1k
R4554 N345 VSS 4.8k
J_B1236 P184 Micro4 0 DR
J_A2645 N333 N345 0 DR
R4555 VDD N333 50k
J_F1200 VDD N333 P186 DR
R4556 P186 N357 1k
R4557 N357 VSS 4.5k
J_Input261 PC_INC N357 0 DR
J_Input262 Micro_Reset N357 0 DR
J_Input263 CF_Load N357 0 DR
J_Input265 Temp_INV N357 0 DR
J_A2672 N339 ISZ_False P187 DR
R4633 VDD N339 100k
J_F1224 VDD N339 P188 DR
R4634 P188 N364 1k
R4635 N364 VSS 4.8k
J_B1250 P187 ISZ P189 DR
J_A2673 N349 N364 0 DR
R4636 VDD N349 50k
J_F1225 VDD N349 P190 DR
R4637 P190 N370 1k
R4638 N370 VSS 4.5k
J_A2674 P189 Micro4 0 DR
J_A2675 N332 ISZ_True P191 DR
R4639 VDD N332 100k
J_F1226 VDD N332 P192 DR
R4640 P192 N356 1k
R4641 N356 VSS 4.8k
J_B1251 P191 ISZ P193 DR
J_A2676 N342 N356 0 DR
R4642 VDD N342 50k
J_F1227 VDD N342 P194 DR
R4643 P194 N367 1k
R4644 N367 VSS 4.5k
J_A2677 P193 Micro4 0 DR
J_Input77 Micro_Reset N370 0 DR
J_Input2 IR1_Load Micro1 0 DR
J_Input3 IR2_Load Micro1 0 DR
J_A1 N328 FIN P195 DR
R1 VDD N328 100k
J_F1 VDD N328 P196 DR
R2 P196 N348 1k
R3 N348 VSS 4.8k
J_B6 P195 Micro4 0 DR
J_A2 N336 N348 0 DR
R4 VDD N336 50k
J_F2 VDD N336 P197 DR
R5 P197 N360 1k
R6 N360 VSS 4.5k
J_Input26 PC3_Bus_Load N253 0 DR
J_Input52 Scratch_Out N253 0 DR
J_Input62 ScratchPadWord1 N161 0 DR
J_Input68 ScratchPad_Load N360 0 DR
J_A5 N377 FIN P198 DR
R13 VDD N377 100k
J_F5 VDD N377 P199 DR
R14 P199 N389 1k
R15 N389 VSS 4.8k
J_B10 P198 Micro5 0 DR
J_A6 N380 N389 0 DR
R16 VDD N380 50k
J_F6 VDD N380 P200 DR
R17 P200 N394 1k
R18 N394 VSS 4.5k
J_Input270 IR3_Out N360 0 DR
J_Input268 ScratchPad_Load N394 0 DR
J_A7 N403 FIN P201 DR
R19 VDD N403 100k
J_F7 VDD N403 P202 DR
R20 P202 N405 1k
R21 N405 VSS 4.8k
J_B12 P201 Micro6 0 DR
J_A8 N404 N405 0 DR
R22 VDD N404 50k
J_F8 VDD N404 P203 DR
R23 P203 N406 1k
R24 N406 VSS 4.5k
J_Input272 IR4_Out N394 0 DR
J_Input55 IndexReg_Load N218 0 DR
J_A11 N151 JIN P204 DR
R31 VDD N151 100k
J_F11 VDD N151 P205 DR
R32 P205 N202 1k
R33 N202 VSS 4.8k
J_B9 P204 Micro2 0 DR
J_A12 N176 N202 0 DR
R34 VDD N176 50k
J_F12 VDD N176 P206 DR
R35 P206 N218 1k
R36 N218 VSS 4.5k
J_Input56 IR2_Out N218 0 DR
J_A13 N288 JIN P207 DR
R37 VDD N288 100k
J_F13 VDD N288 P208 DR
R38 P208 N316 1k
R39 N316 VSS 4.8k
J_B17 P207 Micro3 0 DR
J_A14 N304 N316 0 DR
R40 VDD N304 50k
J_F14 VDD N304 P209 DR
R41 P209 N322 1k
R42 N322 VSS 4.5k
J_Input57 PC2_Bus_Load N218 0 DR
J_Input58 Scratch_Out N218 0 DR
J_A15 N352 JIN P210 DR
R43 VDD N352 100k
J_F15 VDD N352 P211 DR
R44 P211 N371 1k
R45 N371 VSS 4.8k
J_B20 P210 Micro4 0 DR
J_A16 N363 N371 0 DR
R46 VDD N363 50k
J_F16 VDD N363 P212 DR
R47 P212 N374 1k
R48 N374 VSS 4.5k
J_Input66 PC3_Bus_Load N322 0 DR
J_Input69 Scratch_Out N322 0 DR
J_Input273 Micro_Reset N374 0 DR
J_Input37 ScratchPadWord1 N170 0 DR
J_Input14 Scratch_Reg_Select N222 0 DR
J_Input25 Scratch_Reg_Select N219 0 DR
J_Input42 Scratch_Reg_Select N220 0 DR
J_Input48 Scratch_Reg_Select N211 0 DR
J_Input54 Scratch_Reg_Select N295 0 DR
J_Input61 Scratch_Reg_Select N205 0 DR
J_Input44 ScratchPadWord2 N324 0 DR
J_Input45 ScratchPadWord2 N253 0 DR
J_Input80 ScratchPadWord1 N360 0 DR
J_Input81 ScratchPadWord2 N394 0 DR
J_Input82 ScratchPadWord1 N218 0 DR
J_Input83 ScratchPadWord2 N322 0 DR
J_Input65 ScratchPad_Load N313 0 DR
J_Input85 INC_Out N313 0 DR
J_Input86 Scratch_Reg_Select N319 0 DR
J_Input87 Scratch_Reg_Select N313 0 DR
J_Input89 Shift_Enable N208 0 DR
J_Input90 Temp_Load N208 0 DR
J_Input92 CF_Load N298 0 DR
J_A28 N247 RAR P213 DR
R82 VDD N247 100k
J_F26 VDD N247 P214 DR
R83 P214 N286 1k
R84 N286 VSS 4.8k
J_B30 P213 Micro3 0 DR
J_A29 N262 N286 0 DR
R85 VDD N262 50k
J_F27 VDD N262 P215 DR
R86 P215 N300 1k
R87 N300 VSS 4.5k
J_Input91 Temp_Out N300 0 DR
J_Input93 Acc_Load N300 0 DR
J_Input110 CF_Load N300 0 DR
J_Input88 CFStage1_Load N207 0 DR
J_Input111 CFStage1_Load N208 0 DR
J_B33 P157 CF P159 DR
J_Input9 Bus1In N209 0 DR
J_A19 N126 TCS P216 DR
R55 VDD N126 100k
J_F19 VDD N126 P217 DR
R56 P217 N180 1k
R57 N180 VSS 4.8k
J_B34 P218 Micro2 0 DR
J_A20 N149 N180 0 DR
R58 VDD N149 50k
J_F28 VDD N149 P219 DR
R59 P219 N200 1k
R60 N200 VSS 4.5k
J_Input28 Bus3In N200 0 DR
J_Input117 Acc_Load N200 0 DR
J_B35 P216 !CF P218 DR
J_Input118 Bus0In N200 0 DR
J_Input1 IR3_Load Micro1 0 DR
J_Input4 IR4_Load Micro1 0 DR
J_Input5 Scratch_Out N216 0 DR
J_Input6 Temp_Load N216 0 DR
J_Input7 Scratch_Reg_Select N216 0 DR
J_A3 N128 LD P220 DR
R7 VDD N128 100k
J_F3 VDD N128 P221 DR
R8 P221 N182 1k
R9 N182 VSS 4.8k
J_B1 P220 Micro2 0 DR
J_A4 N154 N182 0 DR
R10 VDD N154 50k
J_F4 VDD N154 P222 DR
R11 P222 N205 1k
R12 N205 VSS 4.5k
J_Input8 IR2_Out N205 0 DR
J_Input10 IndexReg_Load N205 0 DR
J_A9 N020 ADD N065 DR
R25 VDD N020 100k
J_F9 VDD N020 P223 DR
R26 P223 N078 1k
R27 N078 VSS 4.8k
J_B2 N065 Micro2 0 DR
J_A10 N044 N078 0 DR
R28 VDD N044 50k
J_F10 VDD N044 P224 DR
R29 P224 N084 1k
R30 N084 VSS 4.5k
J_Input12 IndexReg_Load N084 0 DR
J_Input13 Scratch_Out N084 0 DR
J_Input16 Scratch_Reg_Select N084 0 DR
J_A17 N020 INC N065 DR
J_A18 N020 ISZ N065 DR
J_A21 N020 LD N065 DR
J_A22 N020 SUB N065 DR
J_A23 N020 XCH N065 DR
J_A24 N021 JIN N066 DR
R49 VDD N021 100k
J_F17 VDD N021 P225 DR
R50 P225 N079 1k
R51 N079 VSS 4.8k
J_B3 N066 Micro2 0 DR
J_A25 N045 N079 0 DR
R52 VDD N045 50k
J_F18 VDD N045 P226 DR
R53 P226 P227 1k
R54 P227 VSS 4.5k
J_Input11 IndexReg_Load P227 0 DR
J_A26 N021 FIN N066 DR
J_A27 N021 FIM N066 DR
J_A30 N022 JIN N067 DR
R61 VDD N022 100k
J_F20 VDD N022 P228 DR
R62 P228 N080 1k
R63 N080 VSS 4.8k
J_B4 N067 Micro2 0 DR
J_A31 N046 N080 0 DR
R64 VDD N046 50k
J_F21 VDD N046 P229 DR
R65 P229 P230 1k
R66 P230 VSS 4.5k
J_Input15 Scratch_Out P230 0 DR
J_A32 N022 FIN N067 DR
J_A33 N011 ADD N050 DR
R67 VDD N011 100k
J_F22 VDD N011 P231 DR
R68 P231 N068 1k
R69 N068 VSS 4.8k
J_B5 N050 Micro2 0 DR
J_A34 N035 N068 0 DR
R70 VDD N035 50k
J_F23 VDD N035 P232 DR
R71 P232 P233 1k
R72 P233 VSS 4.5k
J_Input17 Temp_Load P233 0 DR
J_A35 N011 DAA N050 DR
J_A36 N011 DAC N050 DR
J_A37 N011 IAC N050 DR
J_A38 N011 INC N050 DR
J_A39 N011 ISZ N050 DR
J_A40 N011 RAL N050 DR
J_A41 N011 RAR N050 DR
J_A42 N011 SUB N050 DR
J_A43 N011 XCH N050 DR
J_A44 N012 BBL N051 DR
R73 VDD N012 100k
J_F24 VDD N012 P234 DR
R74 P234 N069 1k
R75 N069 VSS 4.8k
J_B7 N051 Micro2 0 DR
J_A45 N036 N069 0 DR
R76 VDD N036 50k
J_F25 VDD N036 P235 DR
R77 P235 P236 1k
R78 P236 VSS 4.5k
J_Input18 Acc_Load P236 0 DR
J_A46 N012 CLB N051 DR
J_A47 N012 LD N051 DR
J_A48 N012 LDM N051 DR
J_A49 N012 TCC N051 DR
J_A51 N012 TCS N051 DR
J_A50 N013 JUN N052 DR
R79 VDD N013 100k
J_F29 VDD N013 P237 DR
R80 P237 N070 1k
R81 N070 VSS 4.8k
J_B8 N052 Micro2 0 DR
J_A52 N037 N070 0 DR
R88 VDD N037 50k
J_F30 VDD N037 P238 DR
R89 P238 P239 1k
R90 P239 VSS 4.5k
J_Input19 PC2_IR_Load P239 0 DR
J_A53 N013 JIN N052 DR
J_A54 N013 FIN N052 DR
J_A55 P240 JCN N052 DR
J_A56 N013 Jumping P240 DR
J_A57 N014 DAC N053 DR
R91 VDD N014 100k
J_F31 VDD N014 P241 DR
R92 P241 N071 1k
R93 N071 VSS 4.8k
J_B11 N053 Micro2 0 DR
J_A58 N038 N071 0 DR
R94 VDD N038 50k
J_F32 VDD N038 P242 DR
R95 P242 P243 1k
R96 P243 VSS 4.5k
J_Input20 Bus0In P243 0 DR
J_A59 N014 IAC N053 DR
J_A60 N014 STC N053 DR
J_A61 P244 TCS N053 DR
J_A62 N014 !CF P244 DR
J_A63 N023 JIN N072 DR
R97 VDD N023 100k
J_F33 VDD N023 P245 DR
R98 P245 N081 1k
R99 N081 VSS 4.8k
J_B13 N072 Micro2 0 DR
J_A64 N047 N081 0 DR
R100 VDD N047 50k
J_F34 VDD N047 P246 DR
R101 P246 P247 1k
R102 P247 VSS 4.5k
J_Input21 ScratchPadWord1 P247 0 DR
J_A65 N023 FIN N072 DR
J_A66 N023 FIM N072 DR
J_A67 N015 RAL N054 DR
R103 VDD N015 100k
J_F35 VDD N015 P248 DR
R104 P248 N073 1k
R105 N073 VSS 4.8k
J_B14 N054 Micro2 0 DR
J_A68 N039 N073 0 DR
R106 VDD N039 50k
J_F36 VDD N039 P249 DR
R107 P249 P250 1k
R108 P250 VSS 4.5k
J_Input22 CFStage1_Load P250 0 DR
J_A69 N015 RAR N054 DR
J_Input23 Shift_Enable N083 0 DR
R109 VDD N016 100k
J_F37 VDD N016 P251 DR
R110 P251 N074 1k
R111 N074 VSS 4.8k
J_B15 N086 Micro2 0 DR
J_A71 N040 N074 0 DR
R112 VDD N040 50k
J_F38 VDD N040 P252 DR
R113 P252 P253 1k
R114 P253 VSS 4.5k
J_Input24 PC3_IR_Load P253 0 DR
J_A73 N016 JUN N086 DR
J_A74 P254 JCN N086 DR
J_A75 N016 Jumping P254 DR
J_A70 N001 CLC N049 DR
R115 VDD N001 100k
J_F39 VDD N001 P255 DR
R116 P255 N055 1k
R117 N055 VSS 4.8k
J_B16 N049 Micro2 0 DR
J_A72 N025 N055 0 DR
R118 VDD N025 50k
J_F40 VDD N025 P256 DR
R119 P256 P257 1k
R120 P257 VSS 4.5k
J_Input27 CF_Clear P257 0 DR
J_A76 N001 CLB N049 DR
J_A77 N002 TCS P258 DR
R121 VDD N002 100k
J_F41 VDD N002 P259 DR
R122 P259 N056 1k
R123 N056 VSS 4.8k
J_B18 P258 Micro2 0 DR
J_A78 N026 N056 0 DR
R124 VDD N026 50k
J_F42 VDD N026 P260 DR
R125 P260 P261 1k
R126 P261 VSS 4.5k
J_Input63 Bus3In P261 0 DR
R127 VDD N003 100k
J_F43 VDD N003 P262 DR
R128 P262 N057 1k
R129 N057 VSS 4.8k
J_B19 N085 Micro2 0 DR
J_A80 N027 N057 0 DR
R130 VDD N027 50k
J_F44 VDD N027 P263 DR
R131 P263 P264 1k
R132 P264 VSS 4.5k
J_Input64 Bus1In P264 0 DR
J_A82 N003 DAA N085 DR
J_A83 P265 TCS N085 DR
J_A84 N003 CF P265 DR
R133 VDD N024 100k
J_F45 VDD N024 P266 DR
R134 P266 N082 1k
R135 N082 VSS 4.8k
J_B21 P267 Micro2 0 DR
J_A79 N048 N082 0 DR
R136 VDD N048 50k
J_F46 VDD N048 P268 DR
R137 P268 P269 1k
R138 P269 VSS 4.5k
J_Input67 Acc_INV P269 0 DR
J_A86 N024 CMA P267 DR
R139 VDD N017 100k
J_F47 VDD N017 P270 DR
R140 P270 N075 1k
R141 N075 VSS 4.8k
J_B22 P271 Micro2 0 DR
J_A81 N041 N075 0 DR
R142 VDD N041 50k
J_F48 VDD N041 P272 DR
R143 P272 P273 1k
R144 P273 VSS 4.5k
J_Input70 CF_Inv P273 0 DR
J_A85 N017 CMC P271 DR
R145 VDD N018 100k
J_F49 VDD N018 P274 DR
R146 P274 N076 1k
R147 N076 VSS 4.8k
J_B23 P275 Micro2 0 DR
J_A87 N042 N076 0 DR
R148 VDD N042 50k
J_F50 VDD N042 P276 DR
R149 P276 P277 1k
R150 P277 VSS 4.5k
J_Input79 Bus2In P277 0 DR
J_A88 N018 DAA P275 DR
R151 VDD N019 100k
J_F51 VDD N019 P278 DR
R152 P278 N077 1k
R153 N077 VSS 4.8k
J_B24 P279 Micro2 0 DR
J_A89 N043 N077 0 DR
R154 VDD N043 50k
J_F52 VDD N043 P280 DR
R155 P280 P281 1k
R156 P281 VSS 4.5k
J_Input84 Subtract_Set P281 0 DR
J_A90 N019 DAC P279 DR
R157 VDD N004 100k
J_F53 VDD N004 P282 DR
R158 P282 N058 1k
R159 N058 VSS 4.8k
J_B25 P283 Micro2 0 DR
J_A91 N028 N058 0 DR
R160 VDD N028 50k
J_F54 VDD N028 P284 DR
R161 P284 P285 1k
R162 P285 VSS 4.5k
J_Input102 ScratchPad_Load P285 0 DR
J_A92 N004 FIM P283 DR
R163 VDD N005 100k
J_F55 VDD N005 P286 DR
R164 P286 N059 1k
R165 N059 VSS 4.8k
J_B26 P287 Micro2 0 DR
J_A93 N029 N059 0 DR
R166 VDD N029 50k
J_F56 VDD N029 P288 DR
R167 P288 P289 1k
R168 P289 VSS 4.5k
J_Input120 Shift_Loading P289 0 DR
J_A94 N005 JMS P287 DR
R169 VDD N006 100k
J_F57 VDD N006 P290 DR
R170 P290 N060 1k
R171 N060 VSS 4.8k
J_B27 P291 Micro2 0 DR
J_A95 N030 N060 0 DR
R172 VDD N030 50k
J_F58 VDD N030 P292 DR
R173 P292 P293 1k
R174 P293 VSS 4.5k
J_Input121 PC1_IR_Load P293 0 DR
J_A96 N006 JUN P291 DR
R175 VDD N007 100k
J_F59 VDD N007 P294 DR
R176 P294 N061 1k
R177 N061 VSS 4.8k
J_B28 P295 Micro2 0 DR
J_A97 N031 N061 0 DR
R178 VDD N031 50k
J_F60 VDD N031 P296 DR
R179 P296 P297 1k
R180 P297 VSS 4.5k
J_Input179 Shift_Direction P297 0 DR
J_A98 N007 RAL P295 DR
R181 VDD N008 100k
J_F61 VDD N008 P298 DR
R182 P298 N062 1k
R183 N062 VSS 4.8k
J_B29 P299 Micro2 0 DR
J_A99 N032 N062 0 DR
R184 VDD N032 50k
J_F62 VDD N032 P300 DR
R185 P300 P301 1k
R186 P301 VSS 4.5k
J_Input180 CF_Load P301 0 DR
J_A100 N008 STC P299 DR
R187 VDD N009 100k
J_F63 VDD N009 P302 DR
R188 P302 N063 1k
R189 N063 VSS 4.8k
J_B31 P303 Micro2 0 DR
J_A101 N033 N063 0 DR
R190 VDD N033 50k
J_F64 VDD N033 P304 DR
R191 P304 P305 1k
R192 P305 VSS 4.5k
J_Input199 Temp_INV P305 0 DR
J_A102 N009 SUB P303 DR
R193 VDD N010 100k
J_F65 VDD N010 P306 DR
R194 P306 N064 1k
R195 N064 VSS 4.8k
J_B32 P307 Micro2 0 DR
J_A103 N034 N064 0 DR
R196 VDD N034 50k
J_F66 VDD N034 P308 DR
R197 P308 P309 1k
R198 P309 VSS 4.5k
J_Input210 CF_Out P309 0 DR
J_A104 N010 TCC P307 DR
J_A105 N106 ADD N108 DR
R199 VDD N106 100k
J_F67 VDD N106 P310 DR
R200 P310 N109 1k
R201 N109 VSS 4.8k
J_B36 N108 Micro4 0 DR
J_A106 N107 N109 0 DR
R202 VDD N107 50k
J_F68 VDD N107 P311 DR
R203 P311 N110 1k
R204 N110 VSS 4.5k
J_Input211 Micro_Reset N110 0 DR
J_A107 N106 BBL N108 DR
J_A108 N106 DAA N108 DR
J_A109 P312 ISZ N108 DR
J_A110 N106 ISZ_True P312 DR
J_A111 N106 DAC N108 DR
J_A112 N106 FIM N108 DR
J_A113 N106 IAC N108 DR
J_A114 N106 INC N108 DR
J_A115 N106 RAL N108 DR
J_A116 N106 RAR N108 DR
J_A117 N106 SUB N108 DR
J_A118 N106 TCC N108 DR
R205 VDD N088 100k
J_F69 VDD N088 P313 DR
R206 P313 N099 1k
R207 N099 VSS 4.8k
J_B37 N096 Micro3 0 DR
J_A120 N092 N099 0 DR
R208 VDD N092 50k
J_F70 VDD N092 P314 DR
R209 P314 N103 1k
R210 N103 VSS 4.5k
J_Input212 Micro_Reset N103 0 DR
J_A123 P315 JCN N096 DR
J_A124 N088 !Jumping P315 DR
J_A125 N088 TCS N096 DR
J_A126 N088 STC N096 DR
J_A127 N088 LDM N096 DR
J_A128 N088 LD N096 DR
J_A129 N088 CMC N096 DR
J_A130 N088 CMA N096 DR
J_A131 N088 CLC N096 DR
J_A132 N088 CLB N096 DR
J_Input213 PC_INC N110 0 DR
J_A133 N106 NOP N108 DR
R211 VDD N087 100k
J_F71 VDD N087 P316 DR
R212 P316 N097 1k
R213 N097 VSS 4.8k
J_B38 N095 Micro3 0 DR
J_A119 N091 N097 0 DR
R214 VDD N091 50k
J_F72 VDD N091 P317 DR
R215 P317 P318 1k
R216 P318 VSS 4.5k
J_Input214 Micro_Reset P318 0 DR
J_A121 N095 JCN N095 DR
J_A122 N087 Jumping N095 DR
J_A141 N087 JUN N095 DR
J_A134 N089 SUB N098 DR
R217 VDD N089 100k
J_F73 VDD N089 P319 DR
R218 P319 N100 1k
R219 N100 VSS 4.8k
J_B39 N098 Micro3 0 DR
J_A135 N093 N100 0 DR
R220 VDD N093 50k
J_F74 VDD N093 P320 DR
R221 P320 N104 1k
R222 N104 VSS 4.5k
J_Input215 Acc_Load N104 0 DR
J_A136 N089 IAC N098 DR
J_A137 N089 DAC N098 DR
J_A138 N089 DAA N098 DR
J_A139 N089 ADD N098 DR
J_Input216 PC_INC N103 0 DR
J_Input217 EO_Out N104 0 DR
J_A140 N090 RAL N101 DR
R223 VDD N090 100k
J_F75 VDD N090 P321 DR
R224 P321 N102 1k
R225 N102 VSS 4.8k
J_B40 N101 Micro3 0 DR
J_A142 N094 N102 0 DR
R226 VDD N094 50k
J_F76 VDD N094 P322 DR
R227 P322 N105 1k
R228 N105 VSS 4.5k
J_Input218 Acc_Load N105 0 DR
J_A143 N090 RAR N101 DR
J_Input219 CF_Load N105 0 DR
J_Input220 Temp_Out N105 0 DR
.model NJF NJF
.model PJF PJF
.lib standard.jft
* M
* X1
* X2
* NOP
* X3
* JCN
* FIM
* FIN
* JUN
* JMS
* INC
* ISZ
* XCH
* LD
* BBL
* LDM
* CLB
* CLC
* IAC
* CMA
* CMC
* RAL
* RAR
* TCC
* DAC
* STC
* TCS
* DAA
* ADD
* SUB
* JIN
.backanno
.end